# EAGLE design pwm_2_dc_motor (EAGLE 7.5.0)
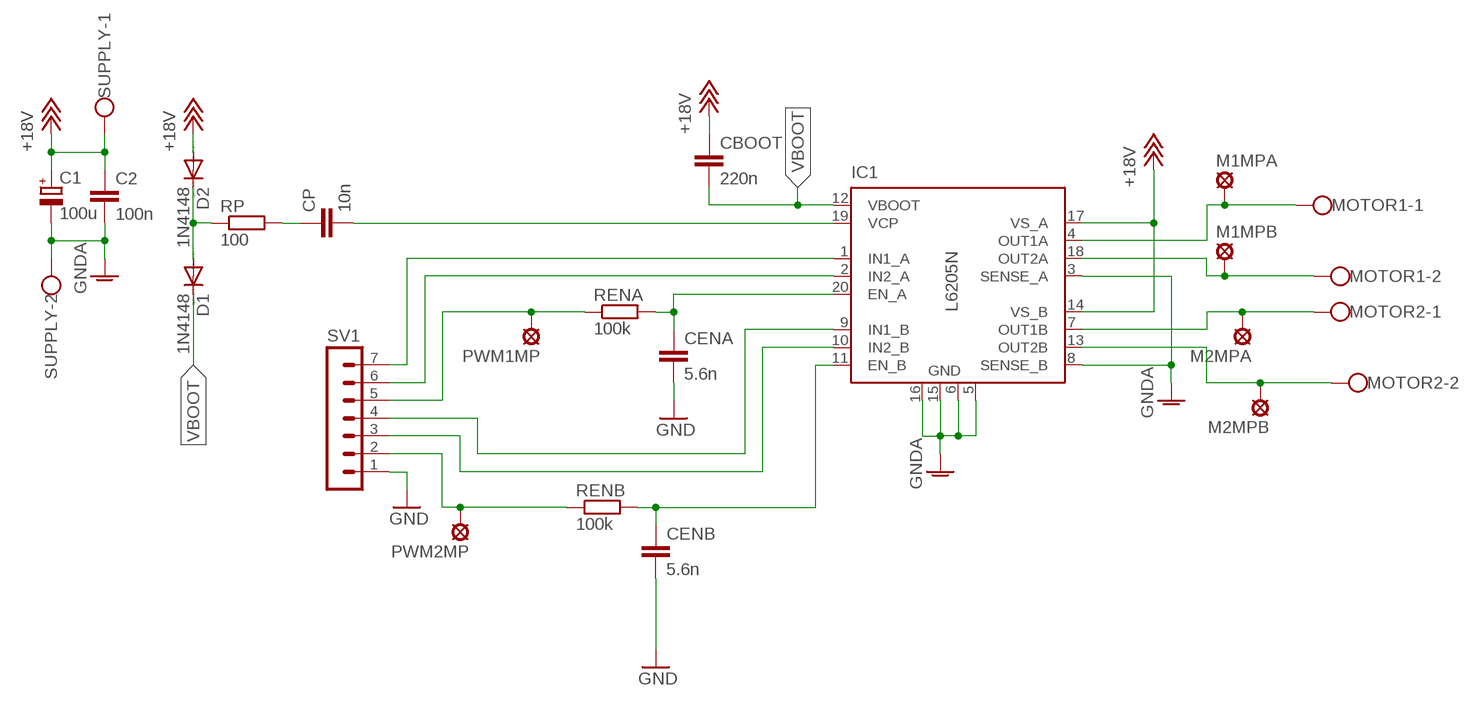
[diagram p0: schematic, sheet 1]

## Parts
C1  100u  CPOL-EUE2,5-6E  [E2,5-6E]
C2  100n  C-EU025-025X050  [C025-025X050]
CBOOT  220n  C-EU025-025X050  [C025-025X050]
CENA  5.6n  C-EU025-025X050  [C025-025X050]
CENB  5.6n  C-EU025-025X050  [C025-025X050]
CP  10n  C-EU025-025X050  [C025-025X050]
D1  1N4148  1N4148DO35-10  [DO35-10]
D2  1N4148  1N4148DO35-10  [DO35-10]
IC1  L6205N  [DIL20]
M1MPA  LSP10  [LSP10]
M1MPB  LSP10  [LSP10]
M2MPA  LSP10  [LSP10]
M2MPB  LSP10  [LSP10]
MOTOR1  W237-102  [W237-102]
MOTOR2  W237-102  [W237-102]
PWM1MP  LSP10  [LSP10]
PWM2MP  LSP10  [LSP10]
RENA  100k  R-EU_0207/10  [0207/10]
RENB  100k  R-EU_0207/10  [0207/10]
RP  100  R-EU_0207/12  [0207/12]
SUPPLY  W237-102  [W237-102]
SV1  MA07-1  [MA07-1]

## Nets
+18V: C1.+ C2.1 CBOOT.1 D2.A IC1.14(VS_B) IC1.17(VS_A) SUPPLY.1
GND: CENA.2 CENB.2 SV1.1
GNDA: C1.- C2.2 IC1.3(SENSE_A) IC1.5(GND) IC1.6(GND) IC1.8(SENSE_B) IC1.15(GND) IC1.16(GND) SUPPLY.2
N$1: IC1.4(OUT1A) M1MPA.MP MOTOR1.1
N$2: IC1.1(IN1_A) SV1.7
N$3: IC1.2(IN2_A) SV1.6
N$4: PWM1MP.MP RENA.1 SV1.5
N$5: IC1.9(IN1_B) SV1.4
N$6: IC1.10(IN2_B) SV1.3
N$7: CENA.1 IC1.20(EN_A) RENA.2
N$8: D1.A D2.C RP.1
N$9: CP.1 RP.2
N$10: CP.2 IC1.19(VCP)
N$11: IC1.18(OUT2A) M1MPB.MP MOTOR1.2
N$12: IC1.7(OUT1B) M2MPA.MP MOTOR2.1
N$13: IC1.13(OUT2B) M2MPB.MP MOTOR2.2
N$14: CENB.1 IC1.11(EN_B) RENB.2
N$15: PWM2MP.MP RENB.1 SV1.2
VBOOT: CBOOT.2 D1.C IC1.12(VBOOT)

## Library data of the parts
C1 = rcl:CPOL-EU: POLARIZED CAPACITOR, European symbol
C2 CBOOT CENA CENB CP = rcl:C-EU: CAPACITOR, European symbol
D1 D2 = diode:1N4148: DIODE high speed (Philips)
IC1 = st-microelectronics:L6205: DUAL DMOS FULL BRIDGE MOTOR DRIVER; MF: Arrow Electronics; MPN: L6205N; OC_FARNELL: 1564367; OC_NEWARK: 89K0754
M1MPA M1MPB M2MPA M2MPB PWM1MP PWM2MP = solpad:LSP10: SOLDER PAD drill 1.0 mm, distributor Buerklin, 12H555
MOTOR1 MOTOR2 SUPPLY = con-wago-500:W237-102: WAGO SCREW CLAMP; MPN: 237-102; OC_FARNELL: unknown; OC_NEWARK: 70K9898
RENA RENB = rcl:R-EU_: RESISTOR, European symbol
RP = resistor:R-EU_: RESISTOR, European symbol
SV1 = con-lstb:MA07-1: PIN HEADER; OC_FARNELL: unknown; OC_NEWARK: unknown

## Board
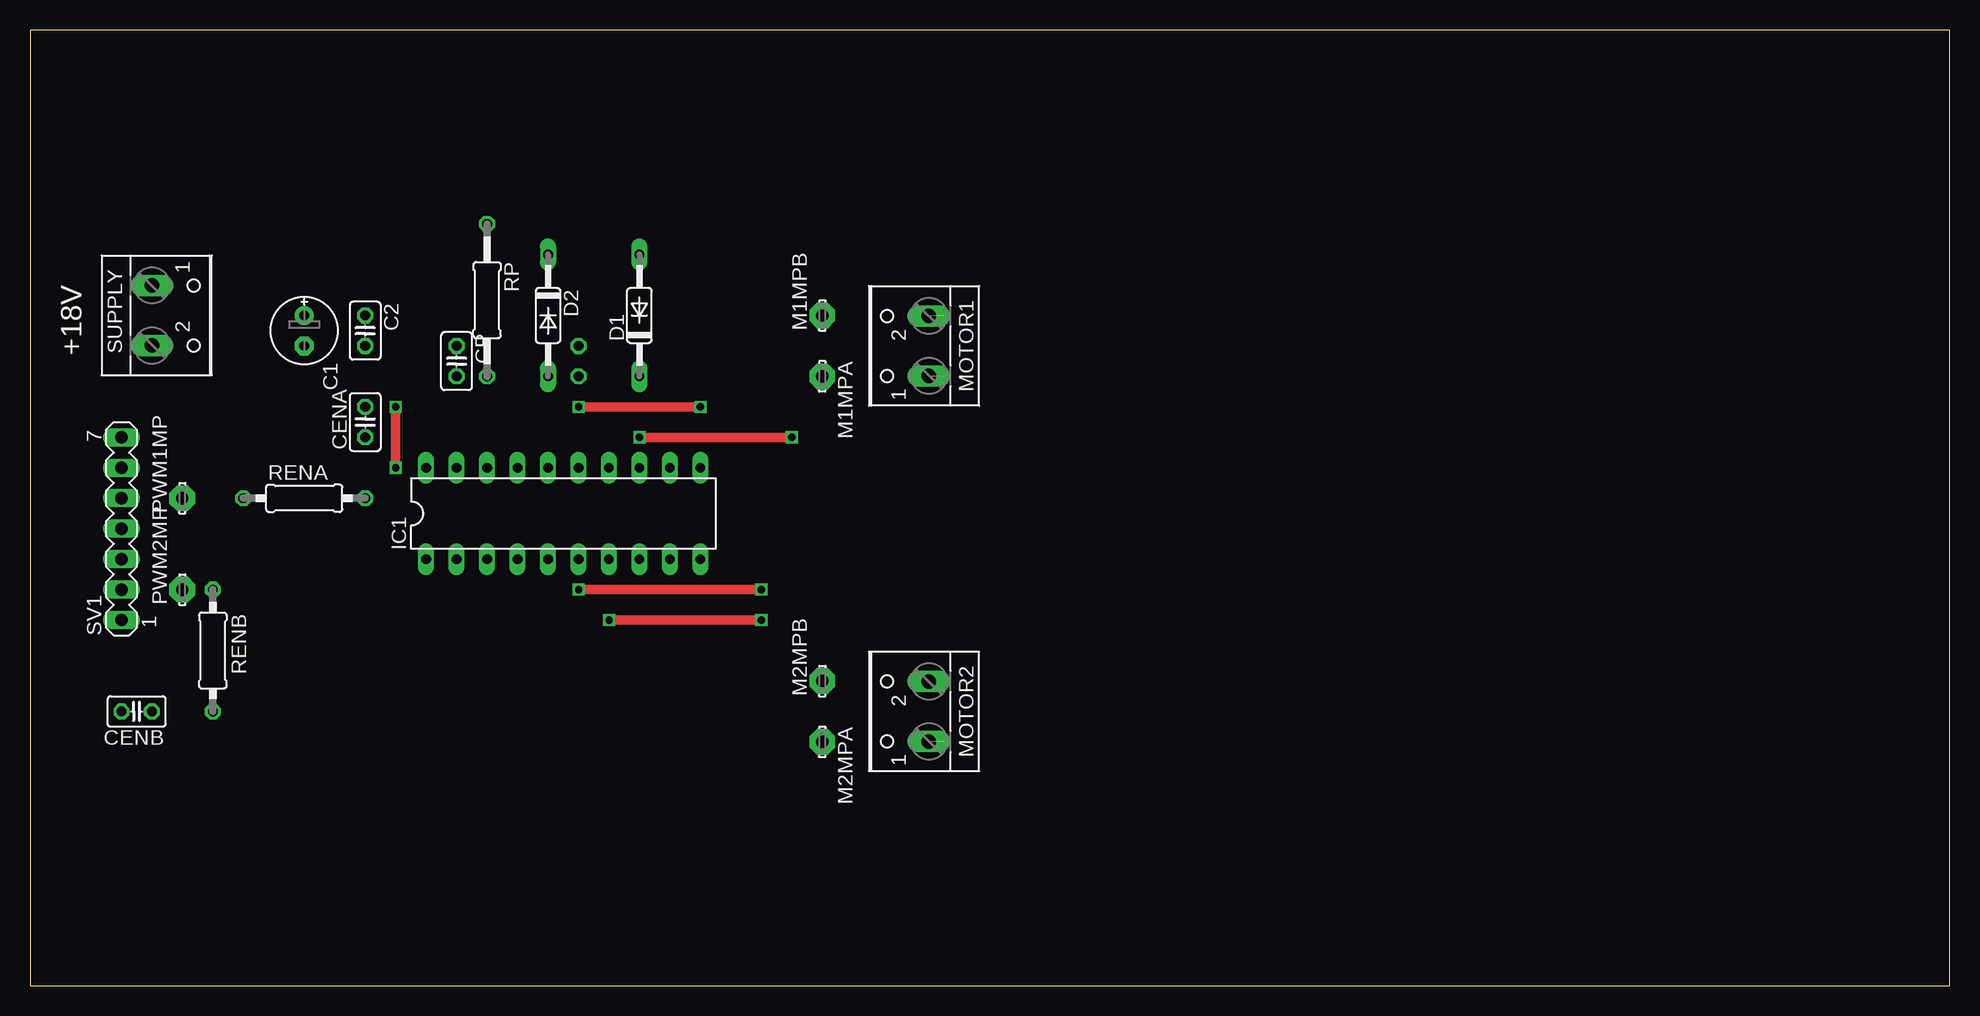
[diagram p1: board, top side]
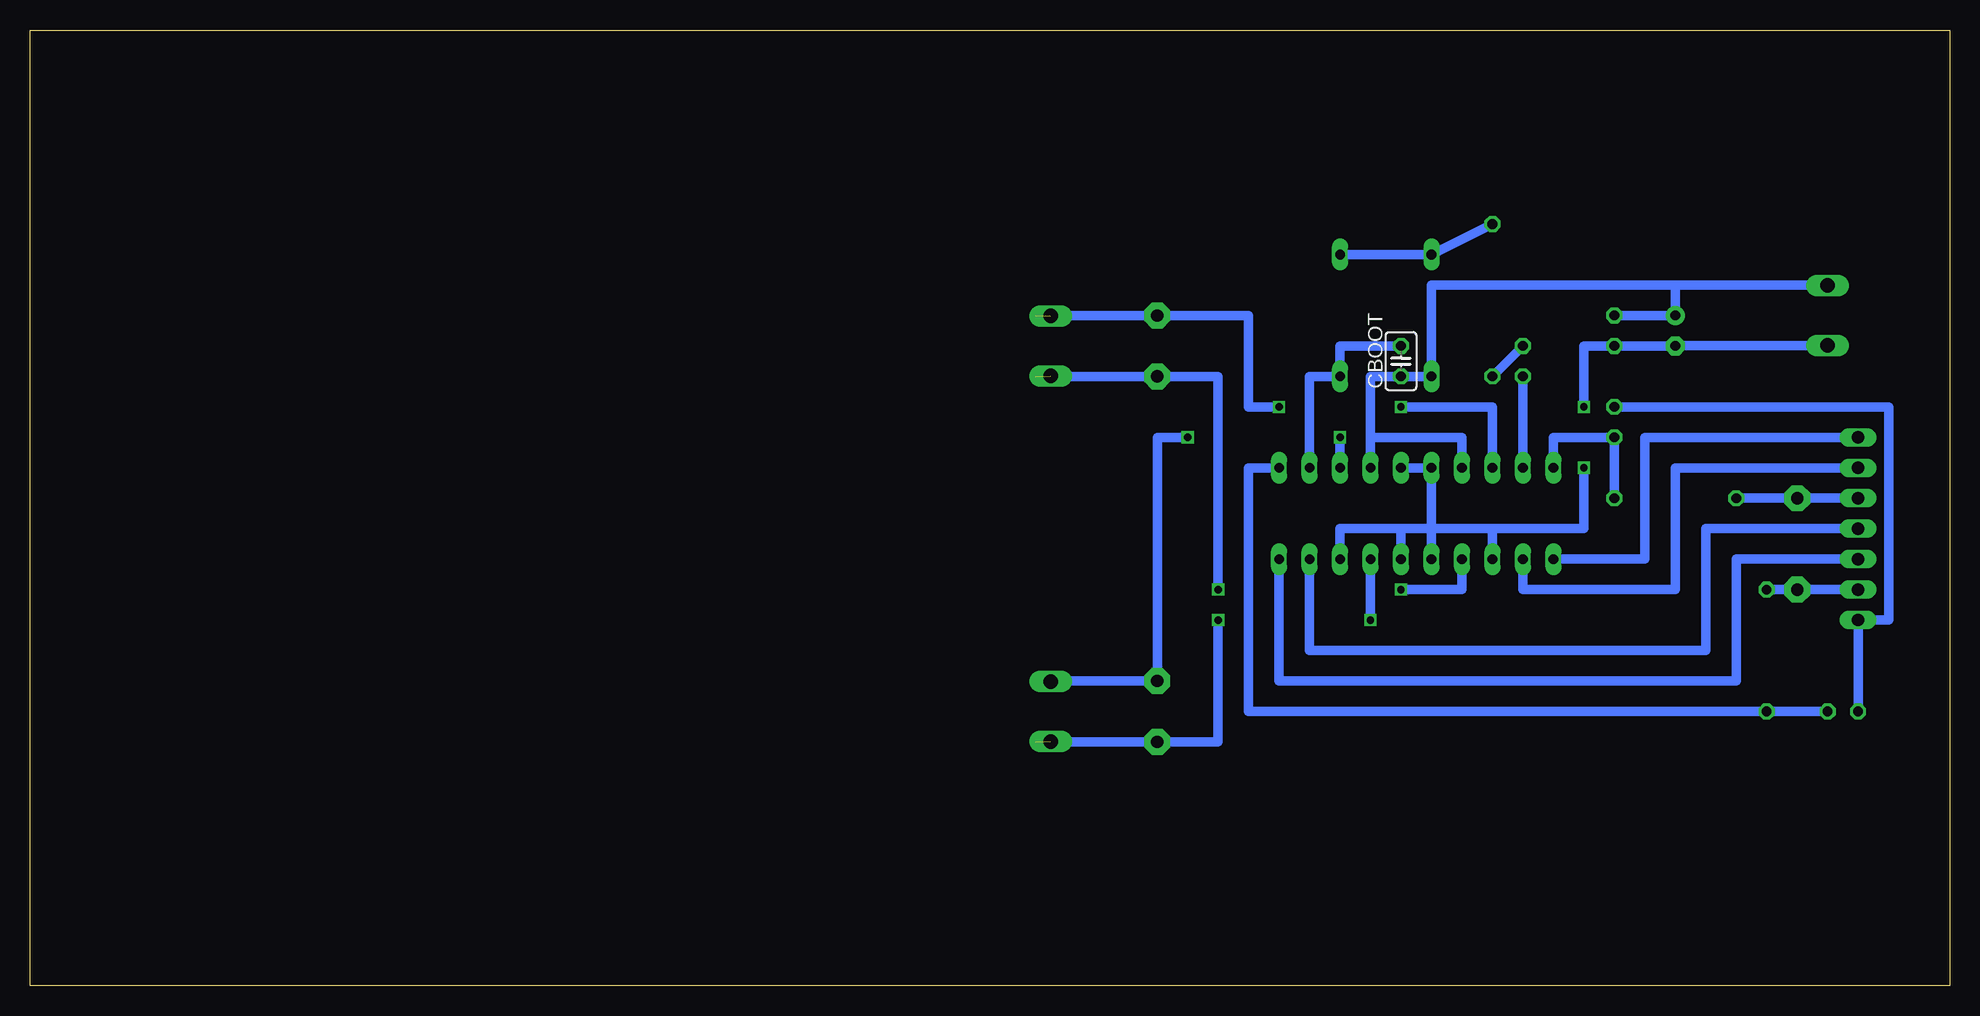
[diagram p2: board, bottom side, seen from below]

Size 160 x 79.68 mm. Coordinates in mm from the lower left corner, seen from the top.
Outline: 0,0 160,0 160,79.68 0,79.68 0,0
Copper layers (1*16): Top 0.035mm / dielectric 1.5mm / Bottom 0.035mm
Design rules "default *": minimum track width 0.8mm, minimum drill 24mil, track to track 50mil, track to pad 50mil, pad to pad 50mil, via to via 50mil, smd to smd 50mil, copper to edge 50mil, drill to drill 50mil, minimum pad ring 10mil, minimum via ring 8mil, stop-mask expansion 4mil, vias tented up to drill 0mil, thermal gap 10mil

### Footprints (pad centres in the part's own frame; a part is rotated, then mirrored left to right if it is on the bottom)
E2,5-6E = drill 0.813 pad 1.575: + -1.27,0 | drill 0.813 pad 1.575 octagon: - 1.27,0
C025-025X050 = drill 0.813 octagon: 1 -1.27,0; 2 1.27,0
DO35-10 = drill 0.813 long: A 5.08,0; C -5.08,0
DIL20 = drill 0.813 long: 1 -11.43,-3.81; 2 -8.89,-3.81; 3 -6.35,-3.81; 4 -3.81,-3.81; 5 -1.27,-3.81; 6 1.27,-3.81; 7 3.81,-3.81; 8 6.35,-3.81; 9 8.89,-3.81; 10 11.43,-3.81; 11 11.43,3.81; 12 8.89,3.81; 13 6.35,3.81; 14 3.81,3.81; 15 1.27,3.81; 16 -1.27,3.81; 17 -3.81,3.81; 18 -6.35,3.81; 19 -8.89,3.81; 20 -11.43,3.81
LSP10 = drill 1.016 pad 2.159 octagon: MP 0,0
W237-102 = drill 1.194 long: 1 -2.5,-1.27; 2 2.5,-1.27
0207/10 = drill 0.813 octagon: 1 -5.08,0; 2 5.08,0
0207/12 = drill 0.813 octagon: 1 -6.35,0; 2 6.35,0
MA07-1 = drill 1.016 long: 1 -7.62,0; 2 -5.08,0; 3 -2.54,0; 4 0,0; 5 2.54,0; 6 5.08,0; 7 7.62,0

### Placement (x,y rotation side)
C1  22.86,54.61 270 top
C2  27.94,54.61 270 top
CBOOT  45.72,52.07 90 bottom
CENA  27.94,46.99 90 top
CENB  8.89,22.86 180 top
CP  35.56,52.07 270 top
D1  50.8,55.88 90 top
D2  43.18,55.88 270 top
IC1  44.45,39.37 0 top
M1MPA  66.04,50.8 270 top
M1MPB  66.04,55.88 90 top
M2MPA  66.04,20.32 270 top
M2MPB  66.04,25.4 90 top
MOTOR1  73.66,53.34 90 top
MOTOR2  73.66,22.86 90 top
PWM1MP  12.7,40.64 90 top
PWM2MP  12.7,33.02 90 top
RENA  22.86,40.64 0 top
RENB  15.24,27.94 270 top
RP  38.1,57.15 270 top
SUPPLY  11.43,55.88 270 top
SV1  7.62,38.1 90 top

### Tracks (layer width: path | path; a pad name or v marks a point on that pad's centre or on a via)
+18V
  Bottom 0.8: 48.26,45.72 48.26,50.8 CBOOT.1 D2.A 43.18,58.42 22.86,58.42 | 48.26,45.72 IC1.14 | 22.86,58.42 C1.+ C2.1 | 22.86,58.42 10.16,58.42 SUPPLY.1 | IC1.17 40.64,45.72 48.26,45.72
GND
  Bottom 0.8: CENA.2 5.08,48.26 5.08,30.48 SV1.1 CENB.2
GNDA  (via drill 0.6)
  Top 0.8: v30.48,48.26 v30.48,43.18
  Bottom 0.8: IC1.15 IC1.16 43.18,38.1 | IC1.5 43.18,38.1 | IC1.8 50.8,38.1 45.72,38.1 | v30.48,48.26 30.48,53.34 C2.2 C1.- 22.86,53.38 SUPPLY.2 | v30.48,43.18 30.48,38.1 38.1,38.1 | 38.1,38.1 43.18,38.1 | IC1.6 45.72,38.1 | 45.72,38.1 43.18,38.1 | IC1.3 38.1,38.1
N$1  (via drill 0.6)  (1 unrouted)
  Top 0.8: v45.72,33.02 v60.96,33.02
  Bottom 0.8: IC1.4 40.64,33.02 v45.72,33.02 | v60.96,33.02 60.96,50.8 M1MPA.MP 76.2,50.8
N$2
  Bottom 0.8: SV1.7 25.4,45.72 25.4,35.56 IC1.1
N$3
  Bottom 0.8: SV1.6 22.86,43.18 22.86,33.02 35.56,33.02 IC1.2
N$4
  Bottom 0.8: SV1.5 PWM1MP.MP RENA.1
N$5
  Bottom 0.8: SV1.4 20.32,38.1 20.32,27.94 53.34,27.94 IC1.9
N$6
  Bottom 0.8: SV1.3 17.78,35.56 17.78,25.4 55.88,25.4 IC1.10
N$7
  Bottom 0.8: RENA.2 CENA.1 33.02,45.72 IC1.20
N$8
  Bottom 0.8: RP.1 D2.C D1.A
N$9
  Bottom 0.8: CP.1 RP.2
N$10
  Bottom 0.8: CP.2 IC1.19
N$11  (via drill 0.6)  (1 unrouted)
  Top 0.8: v45.72,48.26 v55.88,48.26
  Bottom 0.8: IC1.18 38.1,48.26 v45.72,48.26 | v55.88,48.26 58.42,48.26 58.42,55.88 M1MPB.MP 76.2,55.88
N$12  (via drill 0.6)  (1 unrouted)
  Top 0.8: v48.26,30.48 v60.96,30.48
  Bottom 0.8: v60.96,30.48 60.96,20.32 M2MPA.MP 76.2,20.32 | IC1.7 v48.26,30.48
N$13  (via drill 0.6)
  Top 0.8: v50.8,45.72 v63.5,45.72
  Bottom 0.8: IC1.13 v50.8,45.72 | v63.5,45.72 66.04,45.72 M2MPB.MP 74.93,25.4 MOTOR2.2
N$14
  Bottom 0.8: CENB.1 RENB.2 58.42,22.86 58.42,43.18 IC1.11
N$15
  Bottom 0.8: SV1.2 PWM2MP.MP RENB.1
VBOOT
  Bottom 0.8: IC1.12 53.34,50.8 D1.C 50.8,53.34 CBOOT.2

### Text on the board
tNames: +18V